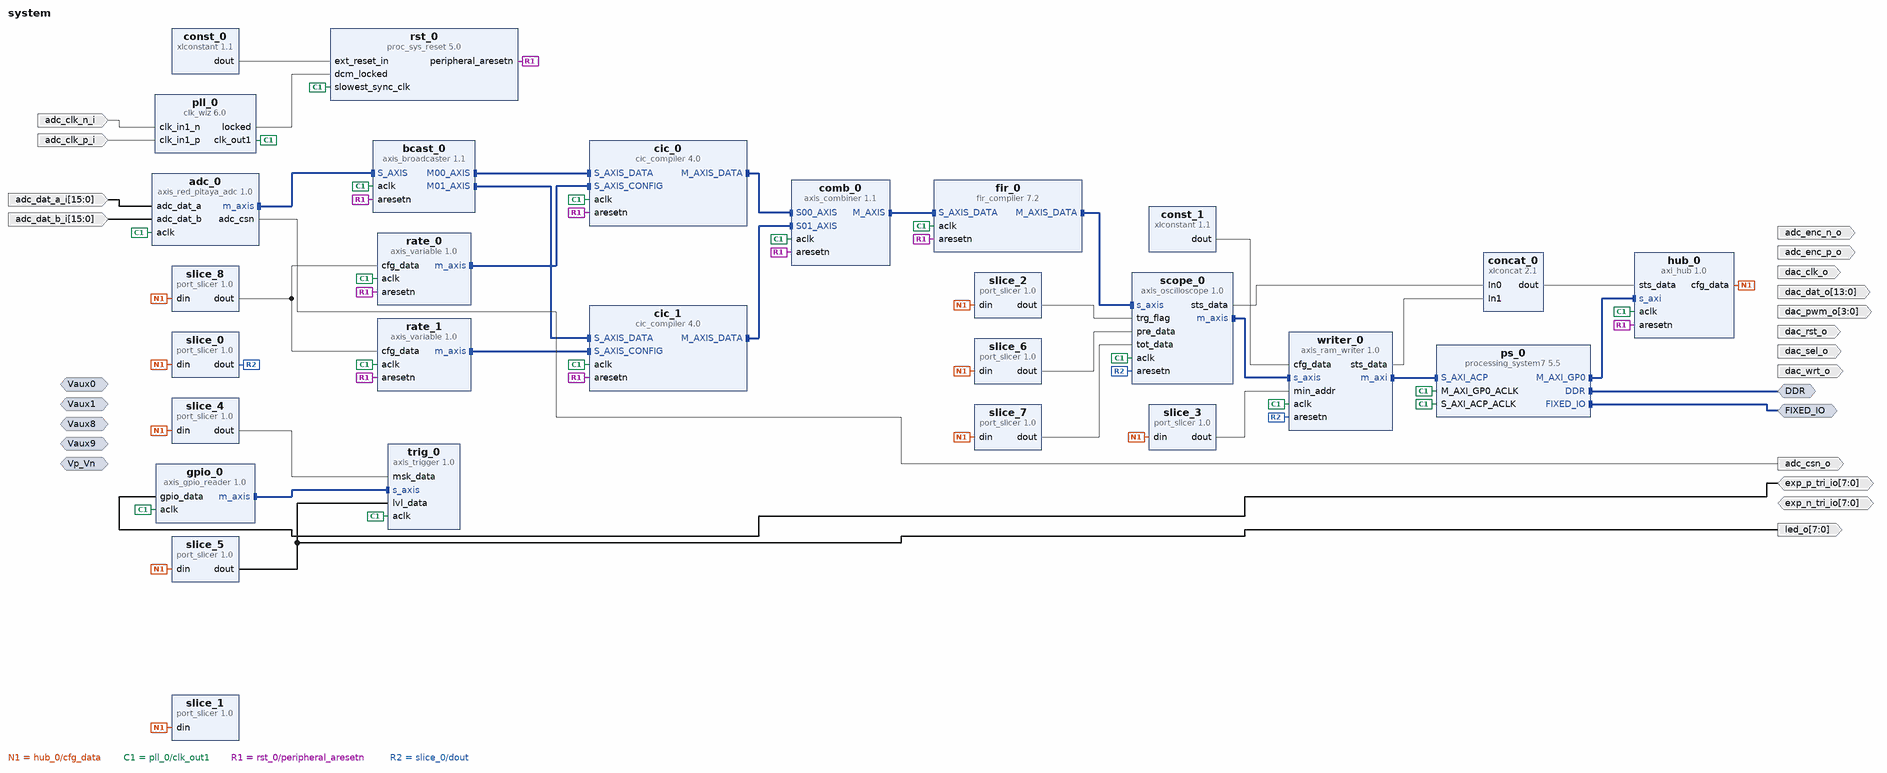
[diagram p0: block diagram of the top level]
# Vivado block design system, xc7z010clg400-1, Vivado 2023.2
create_bd_design system

create_bd_intf_port -mode Slave -vlnv xilinx.com:interface:diff_analog_io_rtl:1.0 Vp_Vn
create_bd_intf_port -mode Slave -vlnv xilinx.com:interface:diff_analog_io_rtl:1.0 Vaux0
create_bd_intf_port -mode Slave -vlnv xilinx.com:interface:diff_analog_io_rtl:1.0 Vaux1
create_bd_intf_port -mode Slave -vlnv xilinx.com:interface:diff_analog_io_rtl:1.0 Vaux9
create_bd_intf_port -mode Slave -vlnv xilinx.com:interface:diff_analog_io_rtl:1.0 Vaux8
create_bd_intf_port -mode Master -vlnv xilinx.com:interface:ddrx_rtl:1.0 DDR
create_bd_intf_port -mode Master -vlnv xilinx.com:display_processing_system7:fixedio_rtl:1.0 FIXED_IO
create_bd_port -dir I -from 15 -to 0 adc_dat_a_i
create_bd_port -dir I -from 15 -to 0 adc_dat_b_i
create_bd_port -dir I adc_clk_p_i
create_bd_port -dir I adc_clk_n_i
create_bd_port -dir O adc_enc_p_o
create_bd_port -dir O adc_enc_n_o
create_bd_port -dir O adc_csn_o
create_bd_port -dir O -from 13 -to 0 dac_dat_o
create_bd_port -dir O dac_clk_o
create_bd_port -dir O dac_rst_o
create_bd_port -dir O dac_sel_o
create_bd_port -dir O dac_wrt_o
create_bd_port -dir O -from 3 -to 0 dac_pwm_o
create_bd_port -dir IO -from 7 -to 0 exp_p_tri_io
create_bd_port -dir IO -from 7 -to 0 exp_n_tri_io
create_bd_port -dir O -from 7 -to 0 led_o

create_bd_cell -type ip -vlnv xilinx.com:ip:clk_wiz:6.0 pll_0
set_property -dict [list \
  CONFIG.CLKOUT1_REQUESTED_OUT_FREQ 125.0 \
  CONFIG.CLKOUT1_USED true \
  CONFIG.PRIMITIVE PLL \
  CONFIG.PRIM_IN_FREQ 125.0 \
  CONFIG.PRIM_SOURCE Differential_clock_capable_pin \
  CONFIG.USE_RESET false \
] [get_bd_cells pll_0]
create_bd_cell -type ip -vlnv xilinx.com:ip:processing_system7:5.5 ps_0
set_property -dict [list \
  CONFIG.PCW_APU_PERIPHERAL_FREQMHZ 666.666666 \
  CONFIG.PCW_ENET0_ENET0_IO {MIO 16 .. 27} \
  CONFIG.PCW_ENET0_GRP_MDIO_ENABLE 1 \
  CONFIG.PCW_ENET0_GRP_MDIO_IO {MIO 52 .. 53} \
  CONFIG.PCW_ENET0_PERIPHERAL_ENABLE 1 \
  CONFIG.PCW_ENET0_RESET_ENABLE 0 \
  CONFIG.PCW_ENET_RESET_ENABLE 1 \
  CONFIG.PCW_ENET_RESET_SELECT {Share reset pin} \
  CONFIG.PCW_FPGA0_PERIPHERAL_FREQMHZ 50 \
  CONFIG.PCW_FPGA1_PERIPHERAL_FREQMHZ 50 \
  CONFIG.PCW_GPIO_EMIO_GPIO_ENABLE 1 \
  CONFIG.PCW_GPIO_EMIO_GPIO_IO 64 \
  CONFIG.PCW_GPIO_MIO_GPIO_ENABLE 1 \
  CONFIG.PCW_GPIO_MIO_GPIO_IO MIO \
  CONFIG.PCW_GPIO_PERIPHERAL_ENABLE 1 \
  CONFIG.PCW_I2C0_GRP_INT_ENABLE 0 \
  CONFIG.PCW_I2C0_I2C0_IO {MIO 50 .. 51} \
  CONFIG.PCW_I2C0_PERIPHERAL_ENABLE 1 \
  CONFIG.PCW_I2C_PERIPHERAL_FREQMHZ 111.111115 \
  CONFIG.PCW_I2C_RESET_ENABLE 1 \
  CONFIG.PCW_I2C_RESET_SELECT {Share reset pin} \
  CONFIG.PCW_IMPORT_BOARD_PRESET cfg/red_pitaya.xml \
  CONFIG.PCW_PRESET_BANK1_VOLTAGE {LVCMOS 2.5V} \
  CONFIG.PCW_QSPI_PERIPHERAL_ENABLE 0 \
  CONFIG.PCW_SD0_GRP_CD_ENABLE 1 \
  CONFIG.PCW_SD0_GRP_CD_IO {MIO 46} \
  CONFIG.PCW_SD0_GRP_WP_ENABLE 1 \
  CONFIG.PCW_SD0_GRP_WP_IO {MIO 47} \
  CONFIG.PCW_SD0_PERIPHERAL_ENABLE 1 \
  CONFIG.PCW_SD0_SD0_IO {MIO 40 .. 45} \
  CONFIG.PCW_SDIO_PERIPHERAL_FREQMHZ 100 \
  CONFIG.PCW_SPI0_PERIPHERAL_ENABLE 1 \
  CONFIG.PCW_SPI0_SPI0_IO EMIO \
  CONFIG.PCW_SPI1_PERIPHERAL_ENABLE 1 \
  CONFIG.PCW_SPI1_SPI1_IO {MIO 10 .. 15} \
  CONFIG.PCW_UART0_PERIPHERAL_ENABLE 1 \
  CONFIG.PCW_UART0_UART0_IO {MIO 14 .. 15} \
  CONFIG.PCW_UART1_PERIPHERAL_ENABLE 1 \
  CONFIG.PCW_UART1_UART1_IO {MIO 8 .. 9} \
  CONFIG.PCW_UART_PERIPHERAL_FREQMHZ 100 \
  CONFIG.PCW_UIPARAM_DDR_BUS_WIDTH {16 Bit} \
  CONFIG.PCW_UIPARAM_DDR_FREQ_MHZ 533.333333 \
  CONFIG.PCW_UIPARAM_DDR_PARTNO {MT41J256M16 RE-125} \
  CONFIG.PCW_USB0_PERIPHERAL_ENABLE 1 \
  CONFIG.PCW_USB0_RESET_ENABLE 1 \
  CONFIG.PCW_USB0_RESET_IO {MIO 48} \
  CONFIG.PCW_USB0_USB0_IO {MIO 28 .. 39} \
  CONFIG.PCW_USB_RESET_ENABLE 1 \
  CONFIG.PCW_USB_RESET_SELECT {Share reset pin} \
  CONFIG.PCW_USE_DEFAULT_ACP_USER_VAL 1 \
  CONFIG.PCW_USE_S_AXI_ACP 1 \
] [get_bd_cells ps_0]
# 429 more settings of ps_0 are not shown: defaults, MIO pin electricals, DDR timing, and values the tool derives
create_bd_cell -type ip -vlnv xilinx.com:ip:xlconstant:1.1 const_0
create_bd_cell -type ip -vlnv xilinx.com:ip:proc_sys_reset:5.0 rst_0
create_bd_cell -type ip -vlnv pavel-demin:user:axis_red_pitaya_adc:1.0 adc_0
set_property -dict {CONFIG.ADC_DATA_WIDTH 14} [get_bd_cells adc_0]
create_bd_cell -type ip -vlnv pavel-demin:user:axis_gpio_reader:1.0 gpio_0
set_property -dict {CONFIG.AXIS_TDATA_WIDTH 8} [get_bd_cells gpio_0]
create_bd_cell -type ip -vlnv pavel-demin:user:axi_hub:1.0 hub_0
set_property -dict {CONFIG.CFG_DATA_WIDTH 192 CONFIG.STS_DATA_WIDTH 64} [get_bd_cells hub_0]
create_bd_cell -type ip -vlnv pavel-demin:user:port_slicer:1.0 slice_0
set_property -dict {CONFIG.DIN_FROM 0 CONFIG.DIN_TO 0 CONFIG.DIN_WIDTH 192} [get_bd_cells slice_0]
create_bd_cell -type ip -vlnv pavel-demin:user:port_slicer:1.0 slice_1
set_property -dict {CONFIG.DIN_FROM 1 CONFIG.DIN_TO 1 CONFIG.DIN_WIDTH 192} [get_bd_cells slice_1]
create_bd_cell -type ip -vlnv pavel-demin:user:port_slicer:1.0 slice_2
set_property -dict {CONFIG.DIN_FROM 16 CONFIG.DIN_TO 16 CONFIG.DIN_WIDTH 192} [get_bd_cells slice_2]
create_bd_cell -type ip -vlnv pavel-demin:user:port_slicer:1.0 slice_3
set_property -dict {CONFIG.DIN_FROM 63 CONFIG.DIN_TO 32 CONFIG.DIN_WIDTH 192} [get_bd_cells slice_3]
create_bd_cell -type ip -vlnv pavel-demin:user:port_slicer:1.0 slice_4
set_property -dict {CONFIG.DIN_FROM 79 CONFIG.DIN_TO 64 CONFIG.DIN_WIDTH 192} [get_bd_cells slice_4]
create_bd_cell -type ip -vlnv pavel-demin:user:port_slicer:1.0 slice_5
set_property -dict {CONFIG.DIN_FROM 95 CONFIG.DIN_TO 80 CONFIG.DIN_WIDTH 192} [get_bd_cells slice_5]
create_bd_cell -type ip -vlnv pavel-demin:user:port_slicer:1.0 slice_6
set_property -dict {CONFIG.DIN_FROM 127 CONFIG.DIN_TO 96 CONFIG.DIN_WIDTH 192} [get_bd_cells slice_6]
create_bd_cell -type ip -vlnv pavel-demin:user:port_slicer:1.0 slice_7
set_property -dict {CONFIG.DIN_FROM 159 CONFIG.DIN_TO 128 CONFIG.DIN_WIDTH 192} [get_bd_cells slice_7]
create_bd_cell -type ip -vlnv pavel-demin:user:port_slicer:1.0 slice_8
set_property -dict {CONFIG.DIN_FROM 175 CONFIG.DIN_TO 160 CONFIG.DIN_WIDTH 192} [get_bd_cells slice_8]
create_bd_cell -type ip -vlnv xilinx.com:ip:axis_broadcaster:1.1 bcast_0
set_property -dict [list \
  CONFIG.M00_TDATA_REMAP {tdata[15:0]} \
  CONFIG.M01_TDATA_REMAP {tdata[31:16]} \
  CONFIG.M_TDATA_NUM_BYTES 2 \
  CONFIG.S_TDATA_NUM_BYTES 4 \
] [get_bd_cells bcast_0]
create_bd_cell -type ip -vlnv pavel-demin:user:axis_variable:1.0 rate_0
set_property -dict {CONFIG.AXIS_TDATA_WIDTH 16} [get_bd_cells rate_0]
create_bd_cell -type ip -vlnv pavel-demin:user:axis_variable:1.0 rate_1
set_property -dict {CONFIG.AXIS_TDATA_WIDTH 16} [get_bd_cells rate_1]
create_bd_cell -type ip -vlnv xilinx.com:ip:cic_compiler:4.0 cic_0
set_property -dict [list \
  CONFIG.Clock_Frequency 125 \
  CONFIG.Filter_Type Decimation \
  CONFIG.Fixed_Or_Initial_Rate 5 \
  CONFIG.HAS_ARESETN true \
  CONFIG.Input_Data_Width 14 \
  CONFIG.Input_Sample_Frequency 125 \
  CONFIG.Maximum_Rate 6250 \
  CONFIG.Minimum_Rate 5 \
  CONFIG.Number_Of_Stages 6 \
  CONFIG.Output_Data_Width 16 \
  CONFIG.Quantization Truncation \
  CONFIG.Sample_Rate_Changes Programmable \
  CONFIG.Use_Xtreme_DSP_Slice false \
] [get_bd_cells cic_0]
create_bd_cell -type ip -vlnv xilinx.com:ip:cic_compiler:4.0 cic_1
set_property -dict [list \
  CONFIG.Clock_Frequency 125 \
  CONFIG.Filter_Type Decimation \
  CONFIG.Fixed_Or_Initial_Rate 5 \
  CONFIG.HAS_ARESETN true \
  CONFIG.Input_Data_Width 14 \
  CONFIG.Input_Sample_Frequency 125 \
  CONFIG.Maximum_Rate 6250 \
  CONFIG.Minimum_Rate 5 \
  CONFIG.Number_Of_Stages 6 \
  CONFIG.Output_Data_Width 16 \
  CONFIG.Quantization Truncation \
  CONFIG.Sample_Rate_Changes Programmable \
  CONFIG.Use_Xtreme_DSP_Slice false \
] [get_bd_cells cic_1]
create_bd_cell -type ip -vlnv xilinx.com:ip:axis_combiner:1.1 comb_0
set_property -dict {CONFIG.TDATA_NUM_BYTES 2} [get_bd_cells comb_0]
create_bd_cell -type ip -vlnv xilinx.com:ip:fir_compiler:7.2 fir_0
set_property -dict [list \
  CONFIG.BestPrecision true \
  CONFIG.Clock_Frequency 125 \
  CONFIG.CoefficientVector {['-1.63744122654648e-08, -4.62216716148361e-08, -3.14335779482632e-10, 3.02310153778336e-08, 1.74890850381969e-08, 3.19482286529326e-08, -5.0994421994774e-09, -1.48653353613353e-07,', '-8.26761935440861e-08, 3.07015823012366e-07, 3.0080886332324e-07, -4.62653063559883e-07, -7.00184893242507e-07, 5.33506302697611e-07, 1.30813357034074e-06, -4.023225322563e-07, -2.10652650584874e-06,', '-7.01725431628003e-08, 3.01150223729751e-06, 1.01967031117686e-06, -3.86150372394275e-06, -2.54225818072438e-06, 4.41993348941294e-06, 4.65304341627651e-06, -4.39753212538659e-06,', '-7.24787717681163e-06, 3.49626558808964e-06, 1.0078701336886e-05, -1.47194685779028e-06, -1.27534942409821e-05, -1.79286233594637e-06, 1.47694078057067e-05, 6.21926306560833e-06, -1.5582846847983e-05,', '-1.14833577256531e-05, 1.47120230922135e-05, 1.70048621091381e-05, -1.18634714639314e-05, -2.19954283147527e-05, 7.05059419354727e-06, 2.55614060867368e-05, -6.89990820946048e-07,', '-2.68697800541403e-05, -6.36451714718008e-06, 2.53527750074515e-05, 1.28728450795703e-05, -2.0920846677794e-05, -1.73612517441299e-05, 1.41401071263444e-05, 1.83749862506759e-05,', '-6.32585991158657e-06, -1.48087387385988e-05, -4.93474951076127e-07, 6.26916256752369e-06, 3.77320372706693e-06, 6.59496436596694e-06, -8.18014683171042e-07, -2.18717457405279e-05,', '-1.07087232130912e-05, 3.63461490752955e-05, 3.21800806140094e-05, -4.57260582225158e-05, -6.34419626433276e-05, 4.5097399118797e-05, 0.000102325890655008, -2.96761791743105e-05, -0.00014443842428366,', '-4.27564702687111e-06, 0.000183291485733018, 5.84704971571537e-05, -0.000210851185795382, -0.000131721288143241, 0.000218509180683351, 0.000219358868548782, -0.000198406916678391,', '-0.000313120548592492, 0.000144959004714433, 0.000401644120432757, -5.63518653243416e-05, -0.000471626935842207, -6.42569578034905e-05, 0.000509602506151267, 0.000208120065222889,', '-0.000504183059896151, -0.000361158959377472, 0.000448371031054935, 0.000505061696434652, -0.000341847567026698, -0.0006195990988342, 0.000192428194445537, 0.000685661560487131, -1.65505528881502e-05,', '-0.000688880371015645, -0.000161641019845141, 0.00062329894459272, 0.000312770999488855, -0.000494493181298271, -0.000406224936898567, 0.000321490786537126, 0.000415356137374431,', '-0.000136895740494839, -0.000323352565488648, -1.52271175908499e-05, 0.000128983871136271, 8.38978661849253e-05, 0.000148695344532513, -1.8069608877988e-05, -0.000467701726518259,', '-0.000224921620006527, 0.000762940586986797, 0.000669359852735534, -0.000950271910714701, -0.00131221385225305, 0.000933507406901155, 0.00211513707866678, -0.000615289331550511, -0.00299952994722302,', '-8.92798158239705e-05, 0.00384566229126372, 0.00123735556393418, -0.00449671320994515, -0.00284293452198785, 0.00476808031019541, 0.00486300922613273, -0.0044617146685581, -0.00718698064468655,', '0.00338458990770112, 0.00963071343738828, -0.0013698211464178, -0.0119360152269839, -0.00170150377088473, 0.0137751539824885, 0.00587879694622239, -0.0147616583115625, -0.0111272087562733,', '0.014457882763948, 0.0173128033439249, -0.012382722980173, -0.0241959325972279, 0.00800309669893809, 0.031425705539797, -0.000692615375256258, -0.0385276197048089, -0.010384517623774,', '0.0448576874366831, 0.0265700861070664, -0.0494359449279653, -0.050506107204478, 0.0503104495147679, 0.0885922374355363, -0.0415657042866342, -0.160704610785777, -0.00838308000357802,', '0.354565700905743, 0.550459213055103, 0.354565700905743, -0.00838308000357801, -0.160704610785777, -0.0415657042866342, 0.0885922374355363, 0.0503104495147679, -0.0505061072044779,', '-0.0494359449279653, 0.0265700861070664, 0.0448576874366831, -0.0103845176237741, -0.0385276197048088, -0.000692615375256252, 0.031425705539797, 0.00800309669893806, -0.0241959325972279,', '-0.0123827229801729, 0.0173128033439249, 0.014457882763948, -0.0111272087562733, -0.0147616583115624, 0.00587879694622238, 0.0137751539824885, -0.00170150377088473, -0.0119360152269839,', '-0.00136982114641781, 0.00963071343738828, 0.00338458990770112, -0.00718698064468655, -0.00446171466855811, 0.00486300922613271, 0.00476808031019541, -0.00284293452198785, -0.00449671320994515,', '0.00123735556393418, 0.00384566229126372, -8.92798158239772e-05, -0.00299952994722302, -0.000615289331550518, 0.00211513707866678, 0.000933507406901159, -0.00131221385225306, -0.000950271910714696,', '0.000669359852735537, 0.000762940586986796, -0.00022492162000653, -0.000467701726518248, -1.80696088779863e-05, 0.0001486953445325, 8.38978661849229e-05, 0.000128983871136272, -1.5227117590845e-05,', '-0.000323352565488649, -0.000136895740494844, 0.000415356137374436, 0.00032149078653713, -0.000406224936898562, -0.000494493181298275, 0.000312770999488843, 0.000623298944592722,', '-0.000161641019845136, -0.000688880371015644, -1.6550552888178e-05, 0.000685661560487131, 0.000192428194445553, -0.0006195990988342, -0.000341847567026709, 0.000505061696434649, 0.000448371031054938,', '-0.000361158959377469, -0.000504183059896154, 0.000208120065222887, 0.000509602506151268, -6.42569578034892e-05, -0.000471626935842202, -5.63518653243425e-05, 0.000401644120432759,', '0.000144959004714433, -0.00031312054859249, -0.000198406916678392, 0.000219358868548782, 0.00021850918068335, -0.000131721288143243, -0.000210851185795382, 5.84704971571526e-05, 0.000183291485733017,', '-4.27564702687076e-06, -0.000144438424283659, -2.96761791743111e-05, 0.000102325890655008, 4.50973991187948e-05, -6.34419626433272e-05, -4.57260582225145e-05, 3.21800806140092e-05,', '3.63461490752936e-05, -1.07087232130911e-05, -2.18717457405289e-05, -8.18014683171156e-07, 6.59496436596684e-06, 3.77320372706711e-06, 6.26916256752231e-06, -4.93474951076179e-07,', '-1.48087387385992e-05, -6.32585991158642e-06, 1.83749862506765e-05, 1.41401071263443e-05, -1.73612517441294e-05, -2.09208466777939e-05, 1.28728450795703e-05, 2.53527750074514e-05,', '-6.36451714717938e-06, -2.68697800541402e-05, -6.8999082094604e-07, 2.55614060867367e-05, 7.05059419354764e-06, -2.19954283147527e-05, -1.18634714639311e-05, 1.70048621091382e-05,', '1.47120230922136e-05, -1.14833577256531e-05, -1.55828468479833e-05, 6.21926306560826e-06, 1.47694078057067e-05, -1.79286233594635e-06, -1.27534942409822e-05, -1.47194685779027e-06,', '1.00787013368863e-05, 3.49626558808964e-06, -7.2478771768118e-06, -4.39753212538663e-06, 4.65304341627645e-06, 4.41993348941295e-06, -2.54225818072432e-06, -3.86150372394272e-06, 1.01967031117682e-06,', '3.01150223729752e-06, -7.01725431628033e-08, -2.10652650584875e-06, -4.02322532256309e-07, 1.30813357034074e-06, 5.33506302697589e-07, -7.00184893242498e-07, -4.62653063559866e-07,', '3.0080886332324e-07, 3.07015823012349e-07, -8.26761935440843e-08, -1.48653353613346e-07, -5.09944219947347e-09, 3.19482286529264e-08, 1.74890850381962e-08, 3.02310153778422e-08, -3.14335779482123e-10,', '-4.62216716148339e-08, -1.63744122654657e-08']} \
  CONFIG.Coefficient_Width 16 \
  CONFIG.Data_Width 16 \
  CONFIG.Decimation_Rate 2 \
  CONFIG.Filter_Type Decimation \
  CONFIG.Has_ARESETn true \
  CONFIG.M_DATA_Has_TREADY true \
  CONFIG.Number_Paths 2 \
  CONFIG.Output_Rounding_Mode Truncate_LSBs \
  CONFIG.Output_Width 16 \
  CONFIG.Quantization Quantize_Only \
  CONFIG.Sample_Frequency 25 \
] [get_bd_cells fir_0]
create_bd_cell -type ip -vlnv pavel-demin:user:axis_trigger:1.0 trig_0
set_property -dict {CONFIG.AXIS_TDATA_SIGNED FALSE CONFIG.AXIS_TDATA_WIDTH 8} [get_bd_cells trig_0]
create_bd_cell -type ip -vlnv pavel-demin:user:axis_oscilloscope:1.0 scope_0
set_property -dict {CONFIG.AXIS_TDATA_WIDTH 32 CONFIG.CNTR_WIDTH 23} [get_bd_cells scope_0]
create_bd_cell -type ip -vlnv xilinx.com:ip:xlconstant:1.1 const_1
set_property -dict {CONFIG.CONST_VAL 262143 CONFIG.CONST_WIDTH 18} [get_bd_cells const_1]
create_bd_cell -type ip -vlnv pavel-demin:user:axis_ram_writer:1.0 writer_0
set_property -dict [list \
  CONFIG.ADDR_WIDTH 18 \
  CONFIG.AXIS_TDATA_WIDTH 32 \
  CONFIG.AXI_ID_WIDTH 3 \
  CONFIG.FIFO_WRITE_DEPTH 1024 \
] [get_bd_cells writer_0]
create_bd_cell -type ip -vlnv xilinx.com:ip:xlconcat:2.1 concat_0
set_property -dict {CONFIG.IN0_WIDTH 32 CONFIG.IN1_WIDTH 32 CONFIG.NUM_PORTS 2} [get_bd_cells concat_0]

# ---- connections ----

connect_bd_intf_net [get_bd_intf_pins bcast_0/S_AXIS] [get_bd_intf_pins adc_0/m_axis]
connect_bd_intf_net [get_bd_intf_pins cic_0/S_AXIS_DATA] [get_bd_intf_pins bcast_0/M00_AXIS]
connect_bd_intf_net [get_bd_intf_pins cic_1/S_AXIS_DATA] [get_bd_intf_pins bcast_0/M01_AXIS]
connect_bd_intf_net [get_bd_intf_pins comb_0/S00_AXIS] [get_bd_intf_pins cic_0/M_AXIS_DATA]
connect_bd_intf_net [get_bd_intf_pins comb_0/S01_AXIS] [get_bd_intf_pins cic_1/M_AXIS_DATA]
connect_bd_intf_net [get_bd_intf_pins fir_0/S_AXIS_DATA] [get_bd_intf_pins comb_0/M_AXIS]
connect_bd_intf_net [get_bd_intf_pins scope_0/s_axis] [get_bd_intf_pins fir_0/M_AXIS_DATA]
connect_bd_intf_net [get_bd_intf_pins trig_0/s_axis] [get_bd_intf_pins gpio_0/m_axis]
connect_bd_intf_net [get_bd_intf_ports DDR] [get_bd_intf_pins ps_0/DDR]
connect_bd_intf_net [get_bd_intf_ports FIXED_IO] [get_bd_intf_pins ps_0/FIXED_IO]
connect_bd_intf_net [get_bd_intf_pins hub_0/s_axi] [get_bd_intf_pins ps_0/M_AXI_GP0]
connect_bd_intf_net [get_bd_intf_pins cic_0/S_AXIS_CONFIG] [get_bd_intf_pins rate_0/m_axis]
connect_bd_intf_net [get_bd_intf_pins cic_1/S_AXIS_CONFIG] [get_bd_intf_pins rate_1/m_axis]
connect_bd_intf_net [get_bd_intf_pins writer_0/s_axis] [get_bd_intf_pins scope_0/m_axis]
connect_bd_intf_net [get_bd_intf_pins writer_0/m_axi] [get_bd_intf_pins ps_0/S_AXI_ACP]
connect_bd_net [get_bd_ports exp_p_tri_io] [get_bd_pins gpio_0/gpio_data]
connect_bd_net [get_bd_pins adc_0/adc_csn] [get_bd_ports adc_csn_o]
connect_bd_net [get_bd_ports adc_clk_n_i] [get_bd_pins pll_0/clk_in1_n]
connect_bd_net [get_bd_ports adc_clk_p_i] [get_bd_pins pll_0/clk_in1_p]
connect_bd_net [get_bd_ports adc_dat_a_i] [get_bd_pins adc_0/adc_dat_a]
connect_bd_net [get_bd_ports adc_dat_b_i] [get_bd_pins adc_0/adc_dat_b]
connect_bd_net [get_bd_pins concat_0/dout] [get_bd_pins hub_0/sts_data]
connect_bd_net [get_bd_pins const_0/dout] [get_bd_pins rst_0/ext_reset_in]
connect_bd_net [get_bd_pins const_1/dout] [get_bd_pins writer_0/cfg_data]
connect_bd_net [get_bd_pins hub_0/cfg_data] \
  [get_bd_pins slice_0/din] [get_bd_pins slice_1/din] [get_bd_pins slice_2/din] [get_bd_pins slice_3/din] \
  [get_bd_pins slice_4/din] [get_bd_pins slice_5/din] [get_bd_pins slice_6/din] [get_bd_pins slice_7/din] \
  [get_bd_pins slice_8/din]
connect_bd_net [get_bd_pins pll_0/clk_out1] \
  [get_bd_pins ps_0/M_AXI_GP0_ACLK] [get_bd_pins ps_0/S_AXI_ACP_ACLK] [get_bd_pins rst_0/slowest_sync_clk] \
  [get_bd_pins adc_0/aclk] [get_bd_pins gpio_0/aclk] [get_bd_pins hub_0/aclk] [get_bd_pins bcast_0/aclk] \
  [get_bd_pins rate_0/aclk] [get_bd_pins rate_1/aclk] [get_bd_pins cic_0/aclk] [get_bd_pins cic_1/aclk] \
  [get_bd_pins comb_0/aclk] [get_bd_pins fir_0/aclk] [get_bd_pins trig_0/aclk] [get_bd_pins scope_0/aclk] \
  [get_bd_pins writer_0/aclk]
connect_bd_net [get_bd_pins pll_0/locked] [get_bd_pins rst_0/dcm_locked]
connect_bd_net [get_bd_pins rst_0/peripheral_aresetn] \
  [get_bd_pins hub_0/aresetn] [get_bd_pins bcast_0/aresetn] [get_bd_pins rate_0/aresetn] [get_bd_pins rate_1/aresetn] \
  [get_bd_pins cic_0/aresetn] [get_bd_pins cic_1/aresetn] [get_bd_pins comb_0/aresetn] [get_bd_pins fir_0/aresetn]
connect_bd_net [get_bd_pins scope_0/sts_data] [get_bd_pins concat_0/In0]
connect_bd_net [get_bd_pins slice_0/dout] [get_bd_pins scope_0/aresetn] [get_bd_pins writer_0/aresetn]
connect_bd_net [get_bd_pins slice_2/dout] [get_bd_pins scope_0/trg_flag]
connect_bd_net [get_bd_pins slice_3/dout] [get_bd_pins writer_0/min_addr]
connect_bd_net [get_bd_pins slice_4/dout] [get_bd_pins trig_0/msk_data]
connect_bd_net [get_bd_pins slice_5/dout] [get_bd_pins trig_0/lvl_data] [get_bd_ports led_o]
connect_bd_net [get_bd_pins slice_6/dout] [get_bd_pins scope_0/pre_data]
connect_bd_net [get_bd_pins slice_7/dout] [get_bd_pins scope_0/tot_data]
connect_bd_net [get_bd_pins slice_8/dout] [get_bd_pins rate_0/cfg_data] [get_bd_pins rate_1/cfg_data]
connect_bd_net [get_bd_pins writer_0/sts_data] [get_bd_pins concat_0/In1]

validate_bd_design
save_bd_design
